# Altium schematic sheet Sheet1.SchDoc
size A4
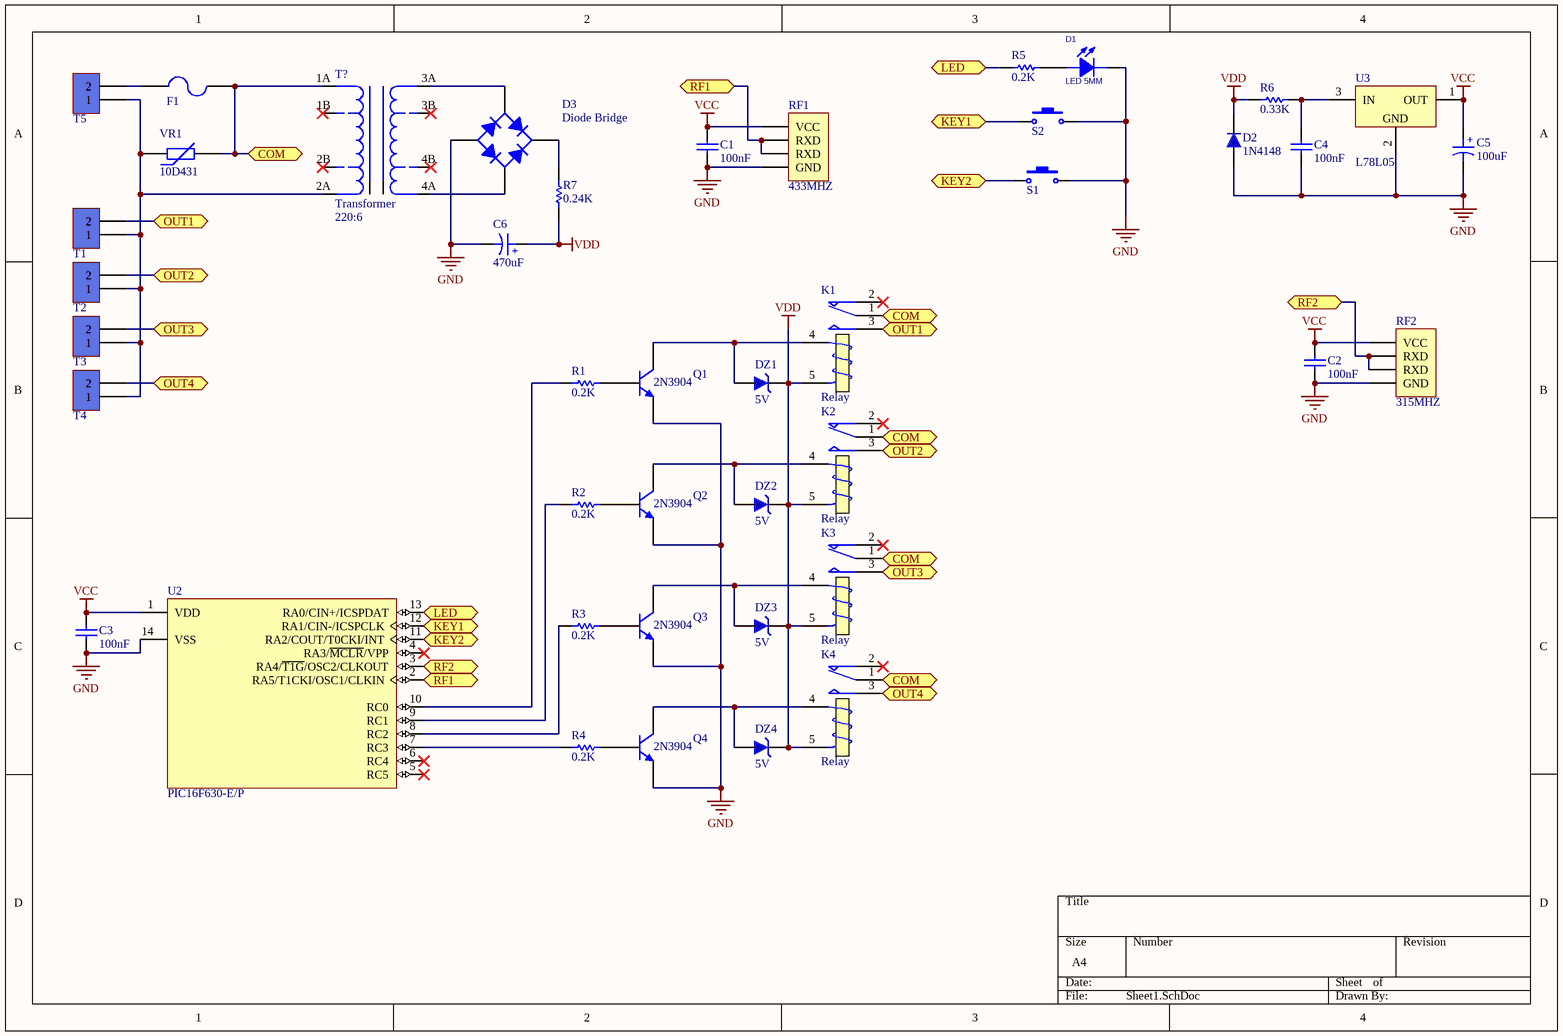
[diagram p0: Sheet1.SchDoc]

## Parts
C1  100nF  [Cap-100nF]
C2  100nF  [Cap-100nF]
C3  100nF  [Cap-100nF]
C4  100nF  [Cap-100nF]
C5  100uF  [Cap electrolitic radial 8x14-3.5]
C6  470uF  [Cap electrolitic radial 8x12-3.5]
D1  LED 5MM  [LED5MM_BLUE]
D2  1N4148  [DO 35]
D3  Diode Bridge  [Bridge WOB PACKAGE]
DZ1  5V  [DO 35]
DZ2  5V  [DO 35]
DZ3  5V  [DO 35]
DZ4  5V  [DO 35]
F1  F=1.0 A  [Fuse 5x20 With holder pin]  (value not drawn)
K1  Relay  [Relay 15.40x12.10x13.10]
K2  Relay  [Relay 15.40x12.10x13.10]
K3  Relay  [Relay 15.40x12.10x13.10]
K4  Relay  [Relay 15.40x12.10x13.10]
Q1  2N3904  [2N3904]  (value not drawn)
Q2  2N3904  [2N3904]  (value not drawn)
Q3  2N3904  [2N3904]  (value not drawn)
Q4  2N3904  [2N3904]  (value not drawn)
R1  0.2K  [RES-(1/4)]
R2  0.2K  [RES-(1/4)]
R3  0.2K  [RES-(1/4)]
R4  0.2K  [RES-(1/4)]
R5  0.2K  [RES-(1/4)]
R6  0.33K  [RES-(1/4)]
R7  0.24K  [RES-(1/4)-Stand]
RF1  433MHZ  [HDR1X4]
RF2  315MHZ  [HDR1X4]
S1  Switch PB  [Switch - Push to On]  (value not drawn)
S2  Switch PB  [Switch - Push to On]  (value not drawn)
T1  KF301_Terminal  [KF301 2PIN]  (value not drawn)
T2  KF301_Terminal  [KF301 2PIN]  (value not drawn)
T3  KF301_Terminal  [KF301 2PIN]  (value not drawn)
T4  KF301_Terminal  [KF301 2PIN]  (value not drawn)
T5  KF301_Terminal  [KF301 2PIN]  (value not drawn)
T?  Transformer  Voltage Ratio: 220:6  [Trans- Small]
U2  PIC16F630-E/P  [DIP14]
U3  L78L05  [78LXX]
VR1  10D431  [10D XXX]

## Ports
COM (bidir), KEY1 (bidir), KEY2 (bidir), LED (bidir), OUT1 (bidir), OUT2 (bidir), OUT3 (bidir), OUT4 (bidir), RF1 (bidir), RF2 (bidir)

## Nets
GND: C1.1 C2.1 C3.1 C4.1 C5.2 C6.2 D1.2(CATHODE) D2.1 D3.4(-) Q1.1(E) Q2.1(E) Q3.1(E) Q4.1(E) RF1.4(GND) RF2.4(GND) S1.2 S2.2 U2.14(VSS) U3.2(GND)
VCC: C1.2 C2.2 C3.2 C5.1 RF1.1(VCC) RF2.1(VCC) U2.1(VDD) U3.1(OUT)
VDD: C6.1 D2.2 DZ1.2 DZ2.2 DZ3.2 DZ4.2 K1.5(T2) K2.5(T2) K3.5(T2) K4.5(T2) R6.2 R7.1
COM: F1.2 K1.1(COM) K2.1(COM) K3.1(COM) K4.1(COM) T?.1A VR1.2 ; port COM
KEY1: S2.1 U2.12(RA1/CIN-/ICSPCLK) ; port KEY1
KEY2: S1.1 U2.11(RA2/COUT/T0CKI/INT) ; port KEY2
LED: R5.1 U2.13(RA0/CIN+/ICSPDAT) ; port LED
OUT1: K1.3(NO) T1.2 ; port OUT1
OUT2: K2.3(NO) T2.2 ; port OUT2
OUT3: K3.3(NO) T3.2 ; port OUT3
OUT4: K4.3(NO) T4.2 ; port OUT4
RF1: RF1.2(RXD) RF1.3(RXD) U2.2(RA5/T1CKI/OSC1/CLKIN) ; port RF1
RF2: RF2.2(RXD) RF2.3(RXD) U2.3(RA4/~{T1G}/OSC2/CLKOUT) ; port RF2
NetC4_2: C4.2 R6.1 U3.3(IN)
NetD1_1: D1.1(ANODE) R5.2
NetD3_1: D3.1(+) R7.2
NetD3_2: D3.2(AC) T?.3A
NetD3_3: D3.3(AC) T?.4A
NetDZ1_1: DZ1.1 K1.4(T1) Q1.3(C)
NetDZ2_1: DZ2.1 K2.4(T1) Q2.3(C)
NetDZ3_1: DZ3.1 K3.4(T1) Q3.3(C)
NetDZ4_1: DZ4.1 K4.4(T1) Q4.3(C)
NetF1_1: F1.1 T5.2
NetQ1_2: Q1.2(B) R1.2
NetQ2_2: Q2.2(B) R2.2
NetQ3_2: Q3.2(B) R3.2
NetQ4_2: Q4.2(B) R4.2
NetR1_1: R1.1 U2.10(RC0)
NetR2_1: R2.1 U2.9(RC1)
NetR3_1: R3.1 U2.8(RC2)
NetR4_1: R4.1 U2.7(RC3)
NetT1_1: T1.1 T2.1 T3.1 T4.1 T5.1 T?.2A VR1.1

Not connected (* = marked no-connect by the designer): K1 2(NC)*; K2 2(NC)*; K3 2(NC)*; K4 2(NC)*; T? 1B* 2B* 3B* 4B* SA SB; U2 4(RA3/~{MCLR}/VPP)* 5(RC5)* 6(RC4)*

## Notes on the sheet
- (in symbol Cap ELECTROLITIC TOTAL SIZE) +

## Library data of the parts
C1-C4 = CAP CERAMIC TOTAL SIZE: CAP Ceramic Total; Designer: Ali Hafizi
C5 C6 = Cap ELECTROLITIC TOTAL SIZE: Cap electrolitic radial; Designer: Abbas Basereh; Data: 16-12-2016; Part. No: *
  C5: VALUE: 100uF
  C6: VALUE: 470uF
D1 = LED 5MM: Light Emitting Diode; Designer: Abbas Basereh; Data: 16-12-2016; Link: *; Part.No: *
D2 = 1N4148: DIODE GEN PURP 100V 200MA DO35; Published: 2017-1-12; PackageVersion: 2017-1-12; PackageReference: DO 35; Publisher: Abbas Basereh; PackageDescription: DIODE GEN PURP 100V 200MA DO35; ComponentLink1Description: Manufacturer Link; ComponentLink1URL: http://www.digikey.com/product-detail/en/fairchild-on-semiconductor/1N4148/1N4148FS-ND/458603; ComponentLink2Description: Datasheet; PART.NO: 1N4148
D3 = Diode Bridge TOTAL SIZE: Full Wave Diode Bridge; Designer: Abbas Basereh; Design Date: 1395/11/09; ComponentLink1Description: Datasheet; ComponentLink2Description: Reference; Mounting Technology: Surface Mount\Through-Hole; Status: Unreleased
DZ1-DZ4 = ZENER GENERAL DIODE: DIODE ZENER GENERAL; Published: 2017-1-12; PackageVersion: 2017-1-12; PackageReference: DO 35; Publisher: Abbas Basereh; PackageDescription: DIODE GEN ZENER; ComponentLink1Description: Manufacturer Link; ComponentLink2Description: Datasheet; VALUE: 5V
F1 = Fuse 5x20 with holdeer pins: Fuses 5x20; Designer: Abbas Basereh; Desc.: fuse with holder pins 5x20; Data: 28-12-2016
K1-K4 = RELAY General: Relay_SPDT POWER NEEDLE; Designer: Ali Hafizi; Company: E.P.I.L; Design_Date: 2011/10/31
Q1-Q4 = 2N3904: NPN Transistor
R1-R7 = RES DIP PACKAGE: TOTAL DIP RESISTOR PACK; Designer: Ali Hafizi
RF1 RF2 = Header 4: RF Receiver; LatestRevisionDate: 17-Jul-2002; LatestRevisionNote: Re-released for DXP Platform.; Publisher: Altium Limited
S1 S2 = Switch PB: Push Button Switch
T1-T5 = KF301-2Pin_Terminal: Terminal 2 Pin 250VAC 16A; Part. No: KF301 2P; Designer: Abbas Basereh; Link: https://www.aliexpress.com/item/
T? = Transformer: Transformer 4 Primary , 4 Secondry; Company: DASE CO; Power: 100W; Adding Date: 10/27/2010
U2 = PIC16F630-E/P: FLASH-Based 8-Bit CMOS Microcontroller, 1K (x14-Bit words) FLASH, 64 Bytes SRAM, 14-Pin PDIP, 2.0 to 5.5V Supply Range, Extended Temperature; Manufacturer: Microchip; DatasheetVersion: revE, Mar-2007; PackageVersion: revBB, Aug-2009; PackageReference: PDIP300-P14; PackageDescription: 14-Lead Plastic Dual In-Line (P) - 300 mil Body [PDIP]; Supplier 1: Digi-Key; Supplier Part Number 1: PIC16F630-E/P-ND; Supplier 2: Newark; Supplier Part Number 2: 92C4542; Supplier 3: Mouser; Supplier Part Number 3: 579-PIC16F630-E/P; PartNumber: PIC16F630-E/P; ComponentLink1Description: Manufacturer URL; ComponentLink1URL: http://www.microchip.com/; ComponentLink2Description: Datasheet; ComponentLink2URL: http://ww1.microchip.com/downloads/en/DeviceDoc/40039E.pdf; ComponentLink3Description: Package Specification; ComponentLink3URL: http://www.microchip.com/stellent/groups/techpub_sg/documents/packagingspec/en012702.pdf
U3 = L78LXX: Fixed Voltage Low Power Regulator; Designer: Saeid Jorablo; Company: ControTec; Adding Date: 1387/01/06; Voltage: *
VR1 = VARISTOR (VDR): VARISTORS; Manufacturer: china-canada-philipina; Designer: Abbas Basereh; Models: MOV-VDR-COV; Data: 2017-1-5; Link: digikey.com; VALUE: 10D431; PUBLISHER: ABBAS BASEREH